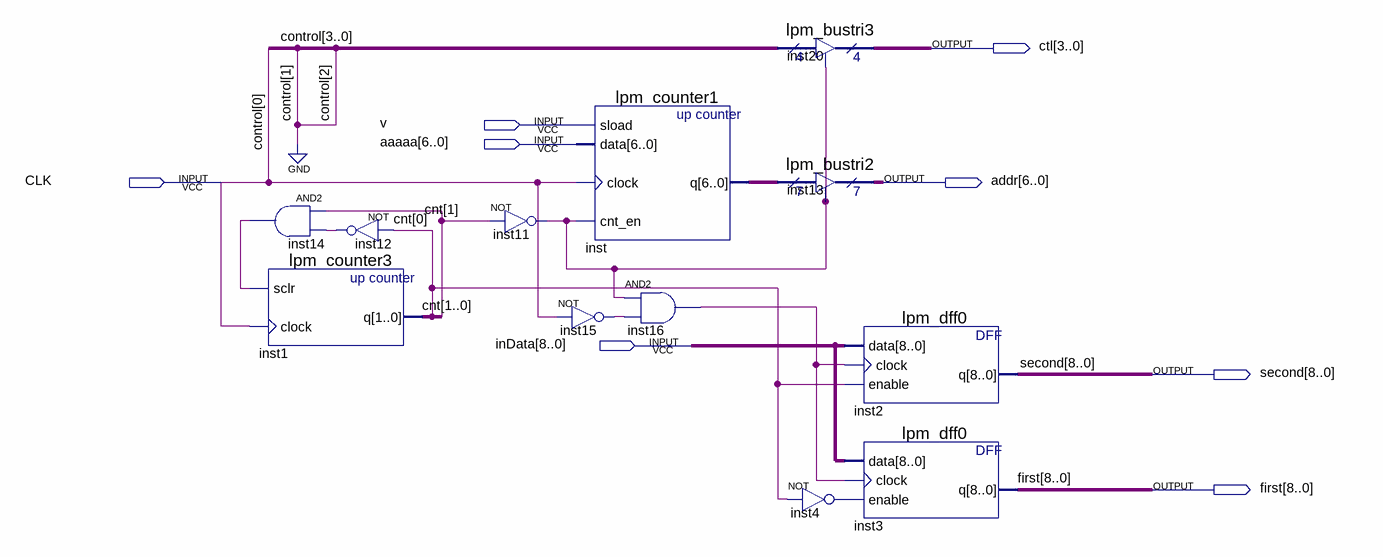
[diagram p0: schematic sheet]
// Quartus schematic test.bdf as structural Verilog: 12 symbols, 8 pins
module test (
  input  v,
  input  [6:0] aaaaa,
  input  CLK,
  input  [8:0] inData,
  output [3:0] ctl,
  output [6:0] addr,
  output [8:0] second,
  output [8:0] first
);

  wire inst4_out, inst11_out, inst12_out, inst14_out, inst15_out, inst16_out;
  wire [1:0] cnt;
  wire [3:3] control;
  wire [6:0] inst_q;

  and inst14 (inst14_out, cnt[1], inst12_out);
  lpm_counter3 inst1 (.sclr(inst14_out), .clock(CLK), .q(cnt));
  not inst12 (inst12_out, cnt[0]);
  not inst11 (inst11_out, cnt[1]);
  not inst15 (inst15_out, CLK);
  lpm_counter1 inst (.sload(v), .data(aaaaa), .clock(CLK), .cnt_en(inst11_out), .q(inst_q));
  and inst16 (inst16_out, inst11_out, inst15_out);
  lpm_bustri3 inst20 (.enabledt(inst11_out), .data({control[3], 2'b00, CLK}), .tridata(ctl));
  lpm_bustri2 inst13 (.enabledt(inst11_out), .data(inst_q), .tridata(addr));
  not inst4 (inst4_out, cnt[0]);
  lpm_dff0 inst2 (.data(inData), .clock(inst16_out), .enable(cnt[0]), .q(second));
  lpm_dff0 inst3 (.data(inData), .clock(inst16_out), .enable(inst4_out), .q(first));

  // Other names for the same wires on the sheet: control[0] = CLK
endmodule
